# Altium project LA432.PrjPCB
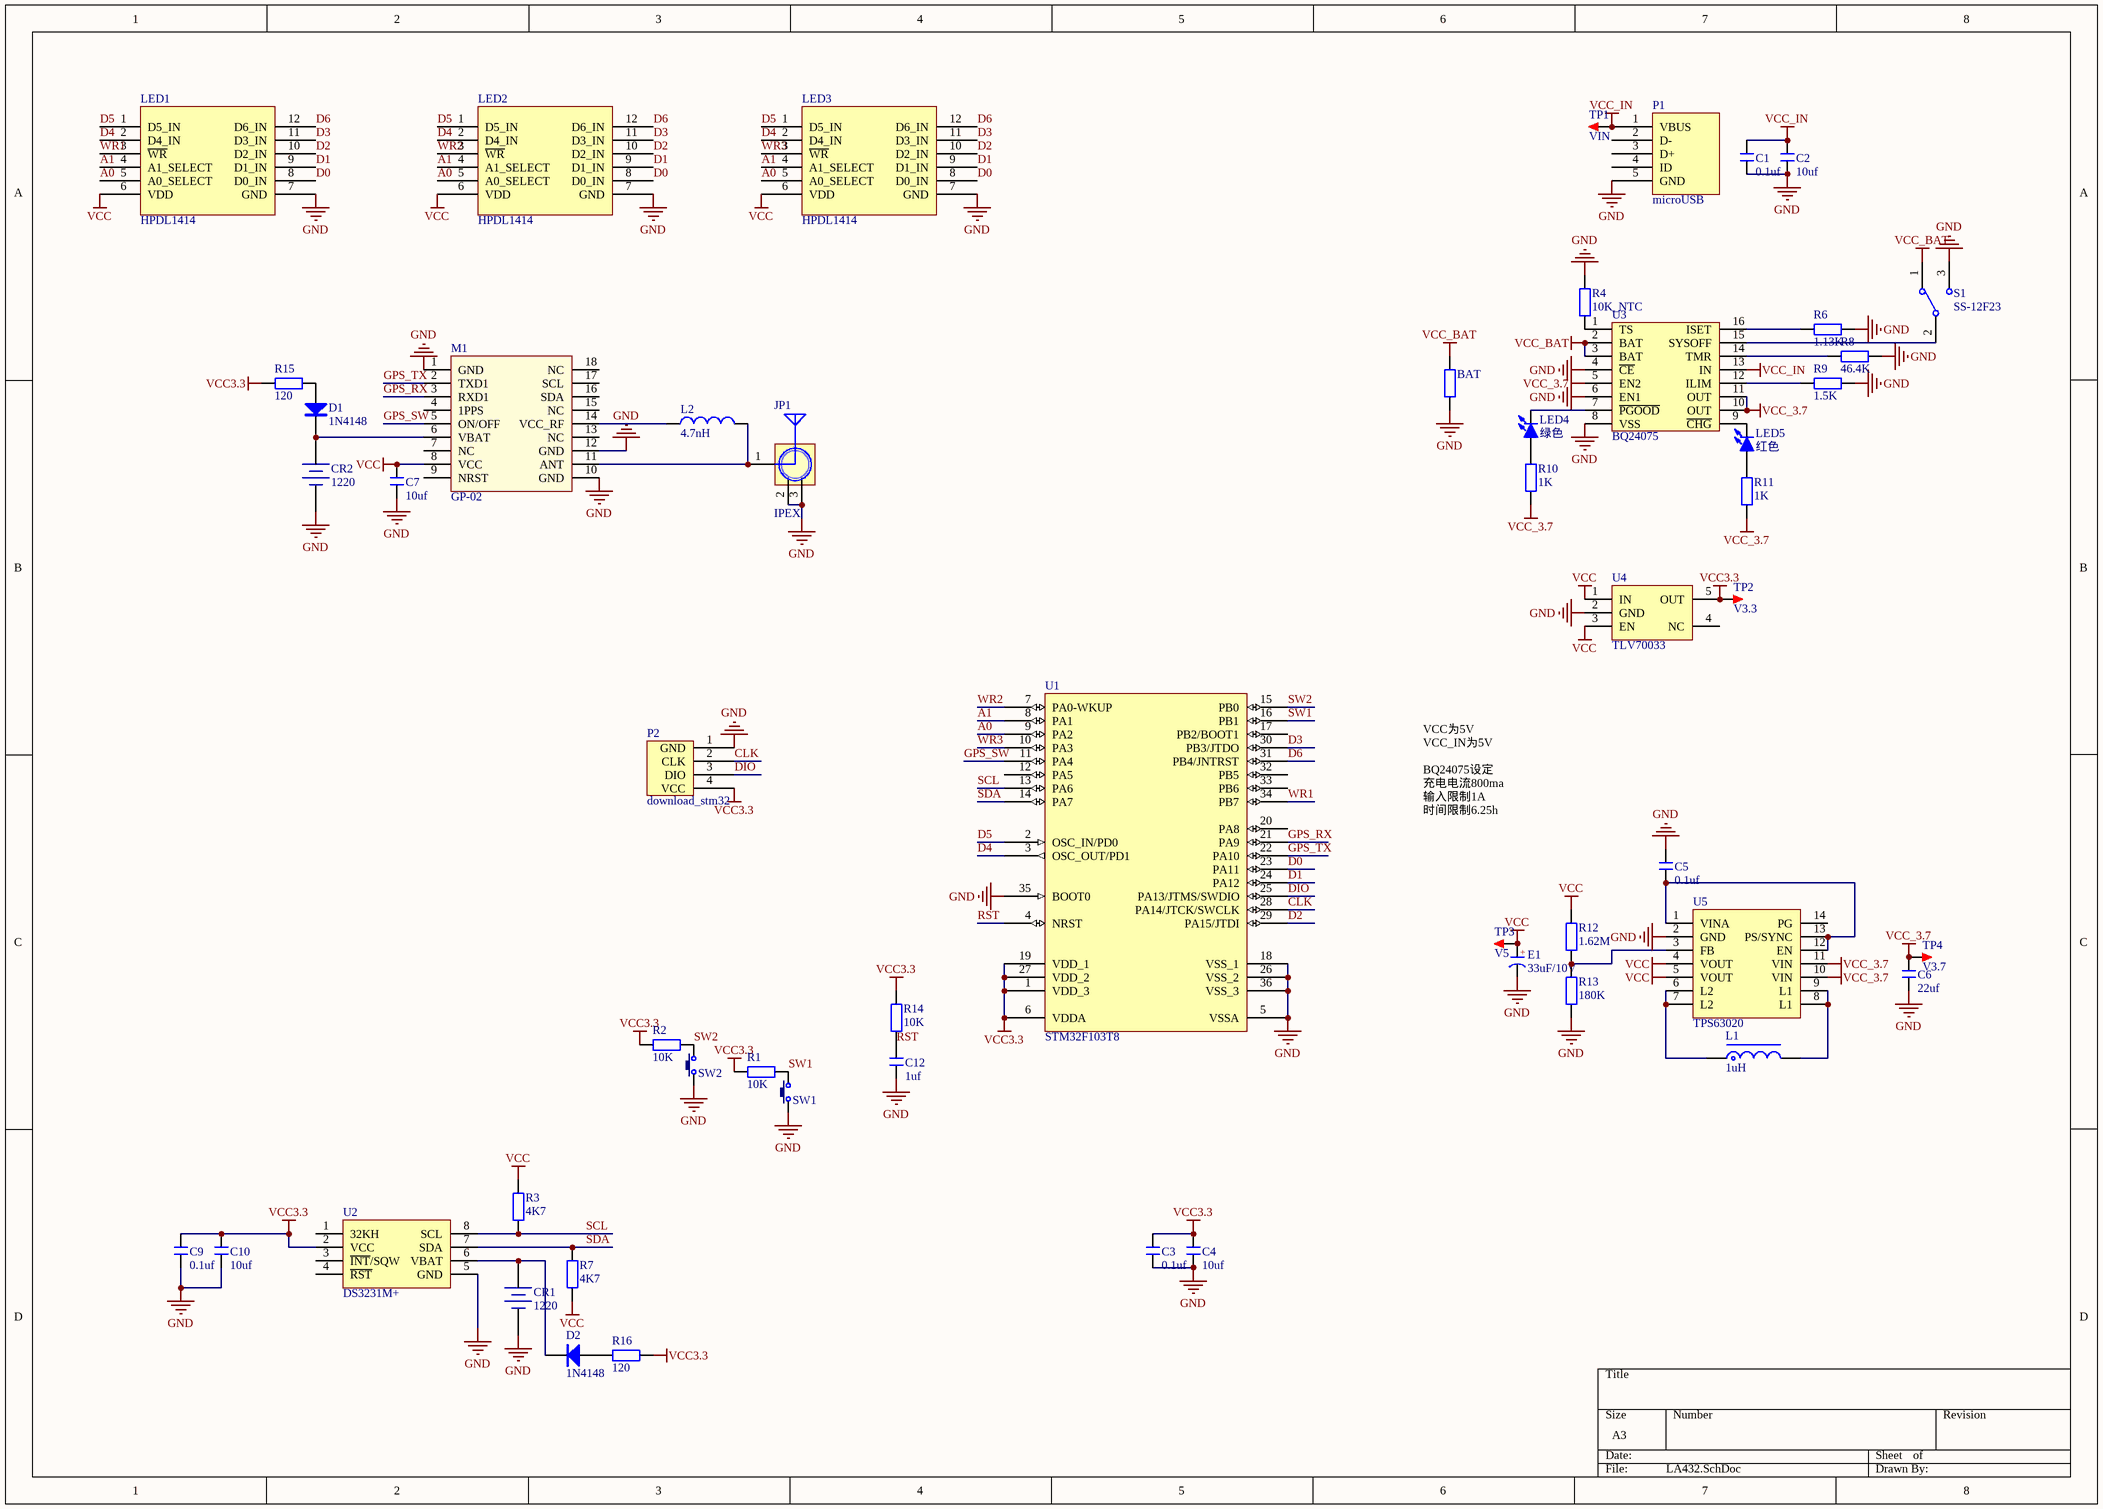
[diagram p0: LA432.SchDoc]
1 sheet, 54 parts. Net scope: global (net labels, ports and power ports of the same name join across sheets).
Board file: LA432.PcbDoc

## Sheet LA432.SchDoc
size A3

### Parts
BAT  (no value)  [R 1206_L]
C1  0.1uf  [C 0603_L]
C2  10uf  [C 0603_L]
C3  0.1uf  [C 0603_L]
C4  10uf  [C 0603_L]
C5  0.1uf  [C 0603_L]
C6  22uf  [C 0603_L]
C7  10uf  [C 0603_L]
C9  0.1uf  [C 0603_L]
C10  10uf  [C 0603_L]
C12  1uf  [C 0603_M]
CR1  1220  [ML621FE]
CR2  1220  [ML621FE]
D1  1N4148  [SOD-323]
D2  1N4148  [SOD-323]
E1  33uF/10V  [CD A(3216)]
JP1  IPEX  [IPEX]
L1  1uH  [L 0805]
L2  4.7nH  [L 0603_L]
LED1  HPDL1414  [HPDL1414]
LED2  HPDL1414  [HPDL1414]
LED3  HPDL1414  [HPDL1414]
LED4  绿色  [LED 0603G]
LED5  红色  [LED 0603R]
M1  GP-02  [GP-02]
P1  microUSB  [microUSB]
P2  download_stm32  [download_round_1.27_stm32]
R1  10K  [R 0603_L]
R2  10K  [R 0603_L]
R3  4K7  [R 0603_L]
R4  10K_NTC  [R 0603_L]
R6  1.13K  [R 0603_L]
R7  4K7  [R 0603_L]
R8  46.4K  [R 0603_L]
R9  1.5K  [R 0603_L]
R10  1K  [R 0603_L]
R11  1K  [R 0603_L]
R12  1.62M  [R 0805_L]
R13  180K  [R 0603_L]
R14  10K  [R 0603_L]
R15  120  [R 0603_L]
R16  120  [R 0603_L]
S1  SS-12F23  [MSK-12C01-07]
SW1  2x4x3.5  [SW 2*4*3.5 SMD]  (value not drawn)
SW2  2x4x3.5  [SW 2*4*3.5 SMD]  (value not drawn)
TP1  VIN  [TEST 1.2]
TP2  V3.3  [TEST 1.2]
TP3  V5  [TEST 1.2]
TP4  V3.7  [TEST 1.2]
U1  STM32F103T8  [VFQFN36 - 6*6]
U2  DS3231M+  [SOP8_N]
U3  BQ24075  [VQFN16]
U4  TLV70033  [SOT23-5L]
U5  TPS63020  [VSON14(DSJ)]

### Nets
GND: BAT.1 C1.1 C2.1 C3.1 C4.1 C5.2 C6.1 C7.1 C9.1 C10.1 C12.1 CR1.2(DC-) CR2.2(DC-) E1.2(K) JP1.2(GND) JP1.3(GND) LED1.7(GND) LED2.7(GND) LED3.7(GND) M1.1(GND) M1.10(GND) M1.12(GND) P1.5(GND) P2.1(GND) R4.2 R6.1 R8.1 R9.1 R13.1 S1.3 SW1.1 SW2.1 U1.5(VSSA) U1.18(VSS_1) U1.26(VSS_2) U1.35(BOOT0) U1.36(VSS_3) U2.5(GND) U3.4(~{CE}) U3.6(EN1) U3.8(VSS) U4.2(GND) U5.2(GND)
VCC: C7.2 E1.1(A) LED1.6(VDD) LED2.6(VDD) LED3.6(VDD) M1.8(VCC) R3.1 R7.2 R12.2 TP3.1 U4.1(IN) U4.3(EN) U5.4(VOUT) U5.5(VOUT)
VCC3.3: C3.2 C4.2 C9.2 C10.2 P2.4(VCC) R1.1 R2.1 R14.2 R15.2 R16.1 TP2.1 U1.1(VDD_3) U1.6(VDDA) U1.19(VDD_1) U1.27(VDD_2) U2.2(VCC) U4.5(OUT)
VCC_3.7: C6.2 R10.1 R11.1 TP4.1 U3.5(EN2) U3.10(OUT) U3.11(OUT) U5.10(VIN) U5.11(VIN)
VCC_BAT: BAT.2 S1.1 U3.2(BAT) U3.3(BAT)
VCC_IN: C1.2 C2.2 P1.1(VBUS) TP1.1 U3.13(IN)
A0: LED1.5(A0_SELECT) LED2.5(A0_SELECT) LED3.5(A0_SELECT) U1.9(PA2)
A1: LED1.4(A1_SELECT) LED2.4(A1_SELECT) LED3.4(A1_SELECT) U1.8(PA1)
CLK: P2.2(CLK) U1.28(PA14/JTCK/SWCLK)
D0: LED1.8(D0_IN) LED2.8(D0_IN) LED3.8(D0_IN) U1.23(PA11)
D1: LED1.9(D1_IN) LED2.9(D1_IN) LED3.9(D1_IN) U1.24(PA12)
D2: LED1.10(D2_IN) LED2.10(D2_IN) LED3.10(D2_IN) U1.29(PA15/JTDI)
D3: LED1.11(D3_IN) LED2.11(D3_IN) LED3.11(D3_IN) U1.30(PB3/JTDO)
D4: LED1.2(D4_IN) LED2.2(D4_IN) LED3.2(D4_IN) U1.3(OSC_OUT/PD1)
D5: LED1.1(D5_IN) LED2.1(D5_IN) LED3.1(D5_IN) U1.2(OSC_IN/PD0)
D6: LED1.12(D6_IN) LED2.12(D6_IN) LED3.12(D6_IN) U1.31(PB4/JNTRST)
DIO: P2.3(DIO) U1.25(PA13/JTMS/SWDIO)
GPS_RX: M1.3(RXD1) U1.21(PA9)
GPS_SW: M1.5(ON/OFF) U1.11(PA4)
GPS_TX: M1.2(TXD1) U1.22(PA10)
RST: C12.2 R14.1 U1.4(NRST)
SCL: R3.2 U1.13(PA6) U2.8(SCL)
SDA: R7.1 U1.14(PA7) U2.7(SDA)
SW1: R1.2 SW1.2 U1.16(PB1)
SW2: R2.2 SW2.2 U1.15(PB0)
WR1: LED1.3(~{WR}) U1.34(PB7)
WR2: LED2.3(~{WR}) U1.7(PA0-WKUP)
WR3: LED3.3(~{WR}) U1.10(PA3)
NetC5_1: C5.1 U5.1(VINA) U5.12(EN) U5.13(PS/SYNC)
NetCR1_1: CR1.1(DC+) D2.2(K) U2.6(VBAT)
NetCR2_1: CR2.1(DC+) D1.2(K) M1.6(VBAT)
NetD1_1: D1.1(A) R15.1
NetD2_1: D2.1(A) R16.2
NetJP1_1: JP1.1(ANT) L2.2 M1.11(ANT)
NetL1_1: L1.1 U5.6(L2) U5.7(L2)
NetL1_2: L1.2 U5.8(L1) U5.9(L1)
NetL2_1: L2.1 M1.14(VCC_RF)
NetLED4_1: LED4.1(A) R10.2
NetLED4_2: LED4.2(K) U3.7(~{PGOOD})
NetLED5_1: LED5.1(A) R11.2
NetLED5_2: LED5.2(K) U3.9(~{CHG})
NetR4_1: R4.1 U3.1(TS)
NetR6_2: R6.2 U3.16(ISET)
NetR8_2: R8.2 U3.14(TMR)
NetR9_2: R9.2 U3.12(ILIM)
NetR12_1: R12.1 R13.2 U5.3(FB)
NetS1_2: S1.2 U3.15(SYSOFF)

Not connected (* = marked no-connect by the designer): M1 4(1PPS) 7(NC) 9(NRST) 13(NC) 15(NC) 16(SDA) 17(SCL) 18(NC); P1 2(D-) 3(D+) 4(ID); U1 12(PA5) 17(PB2/BOOT1) 20(PA8) 32(PB5) 33(PB6); U2 1(32KH) 3(~{INT}/SQW) 4(~{RST}); U4 4(NC); U5 14(PG)

### Notes on the sheet
- VCC为5V
  VCC_IN为5V
  BQ24075设定
  充电电流800ma
  输入限制1A
  时间限制6.25h
- (in symbol C-CD) +

### Library data of the parts
BAT R1-R4 R6-R16 = R: 贴片电阻; 版权归属: 源创客; BOM名称: 贴片电阻; 学习资源: www.ooocke.com
C1-C7 C9 C10 C12 = C: 无极性贴片电容; 版权归属: 源创客; BOM名称: 无极性贴片电容; 学习资源: www.ooocke.com
CR1 CR2 = CR-3V: 微型电池; 版权归属: 源创客; BOM名称: 微型电池; 学习资源: www.ooocke.com
D1 D2 = 1N4148: 高速开关二极管; 版权归属: 源创客; BOM名称: 高速开关二极管; 学习资源: www.ooocke.com
E1 = C-CD: 贴片钽电容; 版权归属: 源创客; BOM名称: 贴片钽电容; 学习资源: www.ooocke.com
JP1 = IPEX: ipex母座; 学习?: www.ooocke.com
L1 = L-CD: 贴片功率电感; BOM名称: 功率电感; 版权归属: 源创客; 学习资源: www.ooocke.com
L2 = L: 小功率贴片电感; 版权归属: 源创客; BOM名称: 小功率贴片电感; 学习资源: www.ooocke.com
LED1-LED3 = HPDL14
LED4 LED5 = LED-SMD: 贴片LED; 版权归属: 源创客; BOM名称: 贴片LED; 学习资源: www.ooocke.com
M1 = G: GPS模块
P1 = microU
S1 = SSW-1P: 1路波动开关; BOM名称: 波动开关; 版权归属: 源创客; 学习资源: www.ooocke.com
SW1 SW2 = SW 2x4: 2x4x3.5轻触开关SMD侧按键; BOM名称: 3x6轻触开关; 版权归属: 源创客; 学习资源: www.ooocke.com
TP1-TP4 = TEST: 测试点; 版权归属: 源创客; BOM名称: 测试点; 学习资源: www.ooocke.com
U3 = BQ24075: 1.5A USB友好型锂离子电池充电器和电源路径管理IC
U4 = TLV70033: 200-mA, Low-I Q , Low-Dropout Regulator for Portable Devices
U5 = TPS63020: 高效率单电感Buck-Boost电压转换器